# EasyEDA Pro project ProPrj_基于STM32的多功能串口分析仪_2025-03-12.epro, board PCB2_1
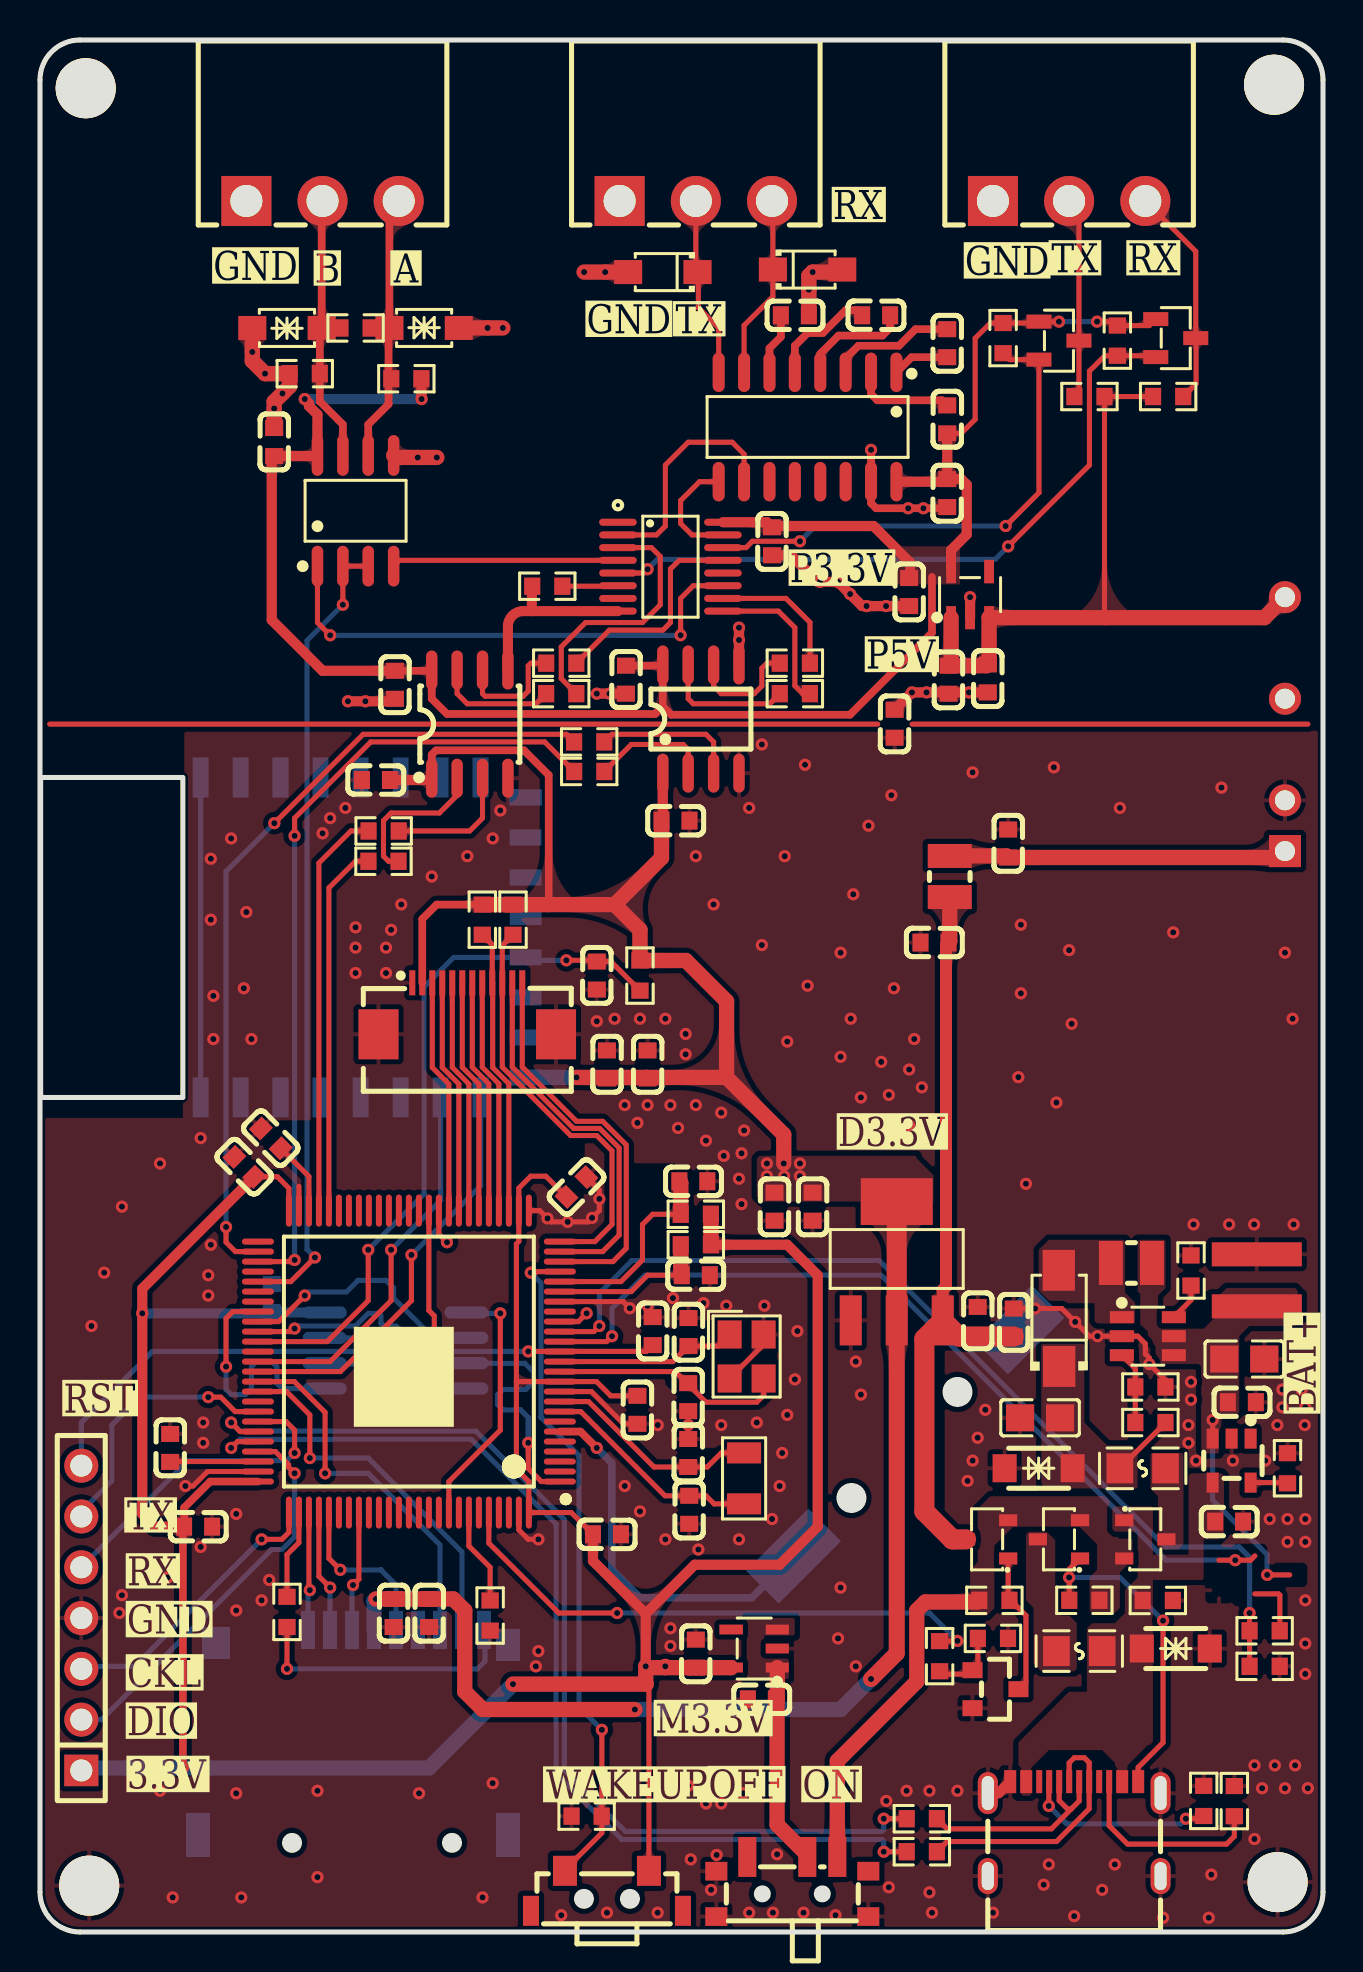
[diagram p15: board, top side]
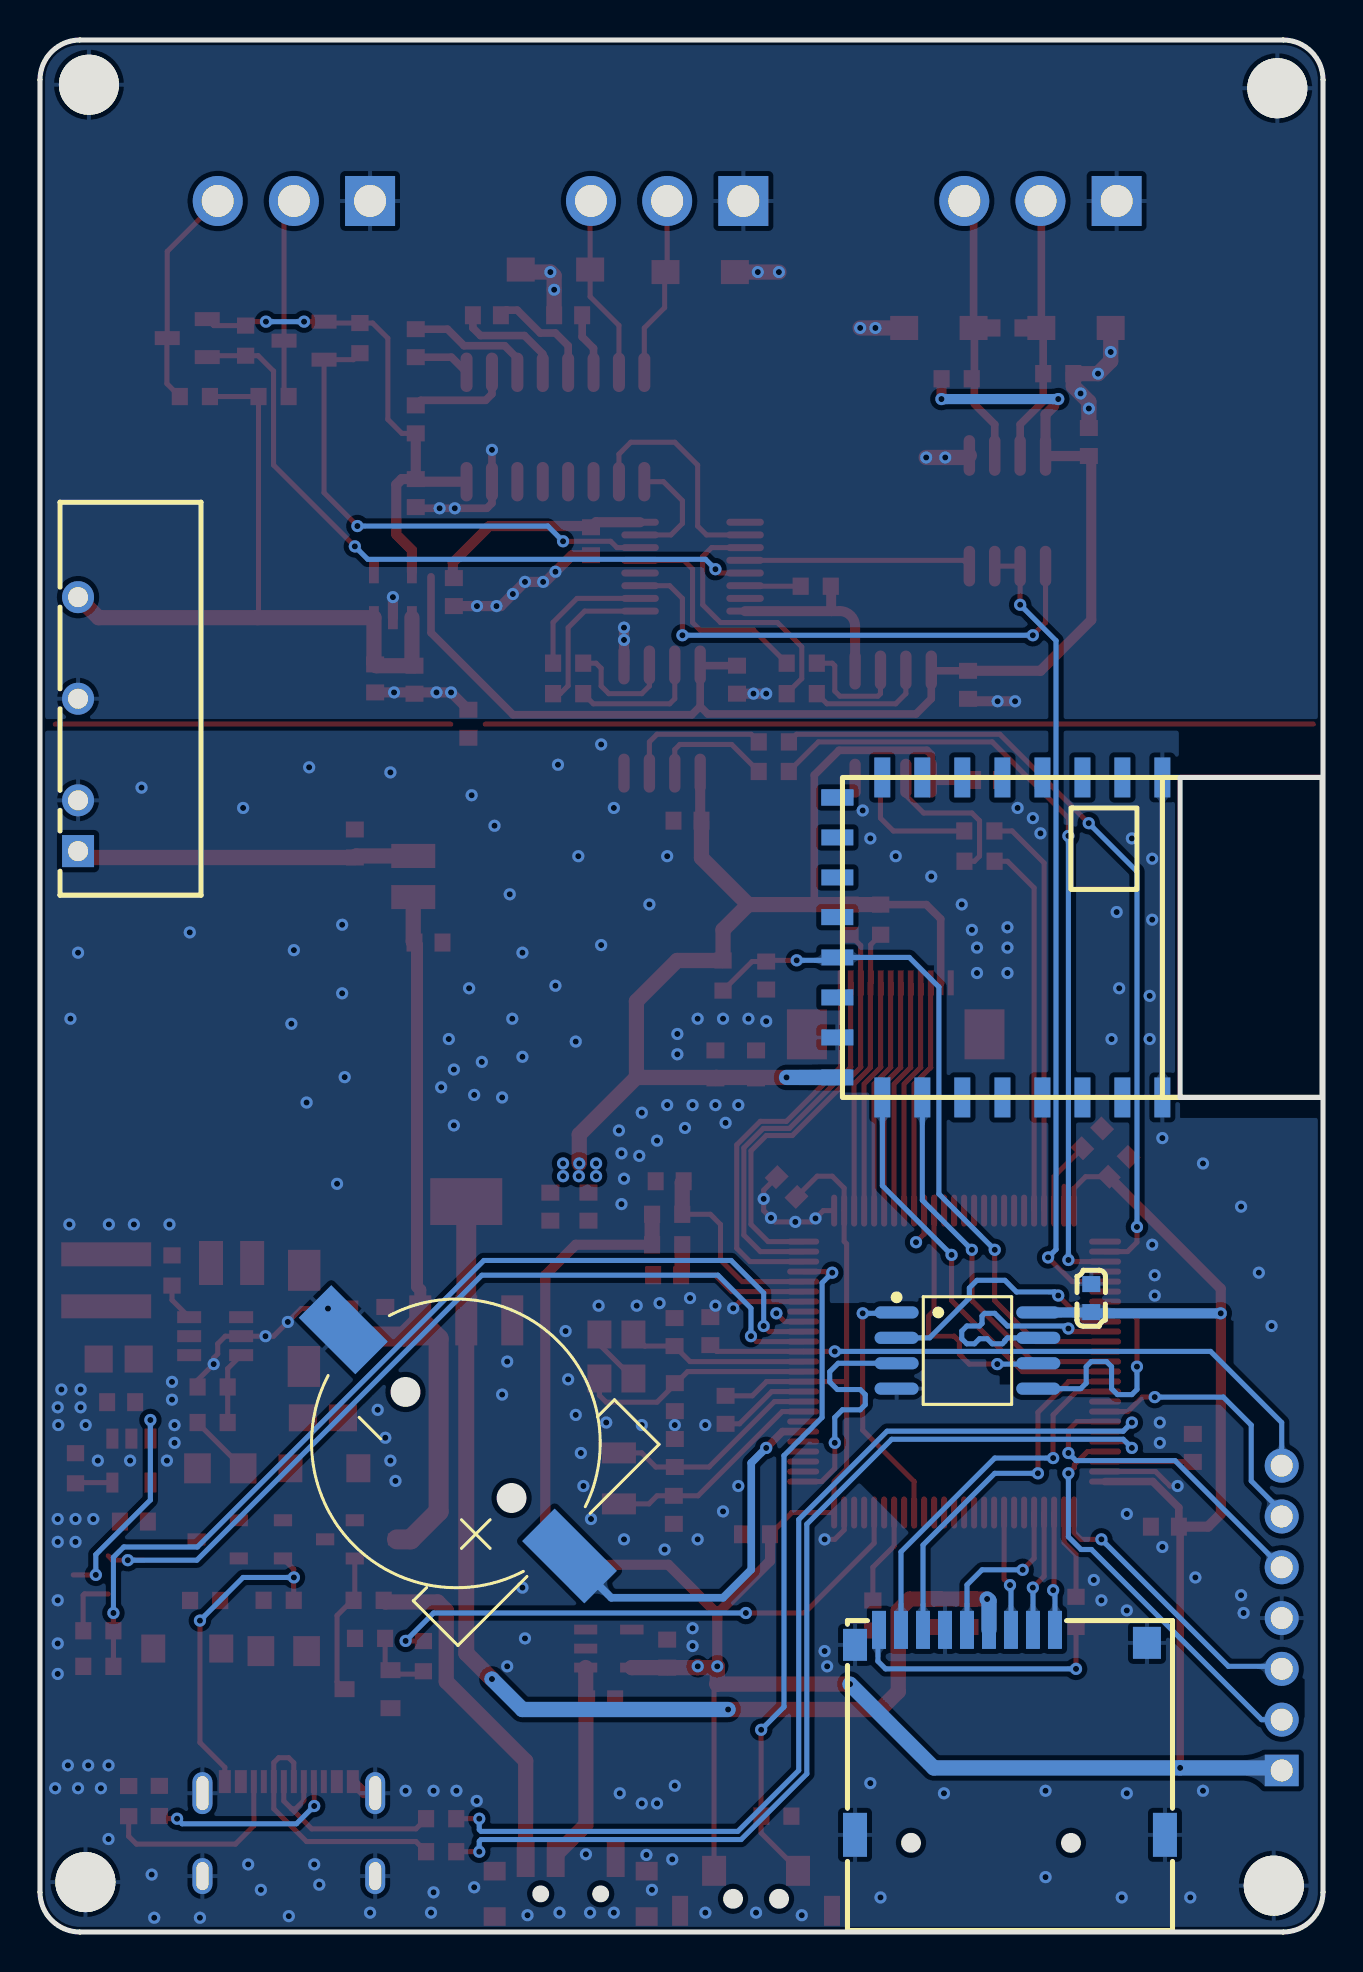
[diagram p16: board, bottom side, seen from below]

Outline 64.17 x 94.62 mm; copper layers: Top Layer, Bottom Layer. Coordinates in mm from the lower left corner of the outline.
Outline path: rectangle 0.03,57.74 7.15,41.73 ; 0,92.62 arc(0.59,94.03) 2,94.62 62.17,94.62 arc(63.58,94.03) 64.17,92.62 64.17,2 arc(63.58,0.59) 62.17,0 2,0 arc(0.59,0.59) 0,2 0,92.62
Stack: Top Layer 0.035mm / Dielectric1 1.51mm FR4 er 4.5 / Bottom Layer 0.035mm

## Design rules (mm)
net PA12: DP1
net PA11: DP1
template: 自定义配置
spacing copperThickness1oz (default): track to track 0.102, other pairs 0.152 to 0.3
spacing copperThickness2oz: track to track 0.203, other pairs 0.152 to 0.3
track width copperThickness1oz (default): min 0.127, default 0.254, max 2.54
track width copperThickness2oz: min 0.203, default 0.254, max 2.54
differential pair differentialPair (default): width min 0.127, default 0.254, max 2.54; gap min 0.152, default 0.152
via viaSize (default): diameter min 0.5, default 0.61, max 10; hole min 0.3, default 0.305, max 6.3
net D3.3V uses PWR
net BAT+ uses PWR
net VBUS uses PWR
net $2N1784 uses PWR
net 5V uses PWR
net $2N3681 uses PWR
net $2N3676 uses PWR
net BAT_5V uses PWR
net $1N15715 uses PWR
net 5V_OUT uses PWR
net $2N39094 uses PWR

## Placement (name value [footprint] x y rotation side)
B1  CR1220-2  [BAT-SMD_CR1220-2]  43.34 24.46 45 bottom
C1  100nF  [C0603]  32.8 32.84 0 top
C2  100nF  [C0603]  30.64 30.05 270 top
C3  100nF  [C0603]  32.68 37.54 180 top
C4  100nF  [C0603]  29.88 26.11 90 top
C5  100nF  [C0603]  26.83 37.26 225 top
C6  100nF  [C0603]  10.22 38.26 315 top
C7  100nF  [C0603]  28.36 19.89 180 top
C8  100nF  [C0603]  7.91 20.27 180 top
C9  1uF  [C0603]  36.1 11.63 0 top
C10  1uF  [C0603]  32.8 13.92 90 top
C11  2.2uF  [C0603]  6.51 24.21 270 top
C12  2.2uF  [C0603]  11.54 39.69 315 top
C13  10pF  [C0603]  32.42 26.75 90 top
C14  10pF  [C0603]  32.42 23.95 270 top
C15  10pF  [C0603]  32.47 21.11 90 top
C16  10pF  [C0603]  32.43 30 90 top
C17  2.2uF  [C0603]  59.47 20.53 180 top
C18  10uF  [C0603]  60.11 26.49 180 top
C19  100nF  [C0603]  45.37 75.64 270 top
C20  100nF  [C0603]  45.37 71.96 90 top
C21  100nF  [C0603]  17.69 15.95 90 top
C22  10uF  [C0603]  19.47 15.95 90 top
C23  100nF  [C0603]  41.82 80.85 0 top
C24  100nF  [C0603]  45.37 79.45 90 top
C25  100nF  [C0603]  37.75 80.85 180 top
C26  22uF  [C0805]  50.02 25.71 0 top
C27  22uF  [C0805]  60.23 28.65 180 top
C28  100nF  [C0603]  16.8 57.61 0 top
C29  100nF  [C0603]  17.75 62.37 270 top
C30  100nF  [C0603]  11.71 74.51 270 top
C31  100nF  [C0603]  31.78 55.58 180 top
C32  100nF  [C0603]  29.31 62.63 270 top
C33  4.7uF  [C0603]  44.74 49.48 0 top
C34  4.7uF  [C0603]  48.42 54.43 270 top
C35  10uF  [C0603]  47.41 62.69 90 top
C36  1uF  [C0603]  45.44 62.62 90 top
C37  1uF  [C0603]  43.47 67.01 270 top
C38  1nF  [C0603]  42.74 60.42 90 top
C39  100nF  [C0603]  36.61 69.55 90 top
C40  100nF  [C0603]  48.7 30.48 270 top
C41  10uF  [C0603]  46.9 30.56 270 top
C42  100nF  [C0603]  36.74 36.27 90 top
C43  10uF  [C0603]  38.64 36.27 90 top
C44  100nF  [C0603]  30.39 43.39 270 top
C45  10uF  [C0603]  28.36 43.39 270 top
C46  100nF  [C0603]  27.85 47.83 270 top
C47  100nF  [C0603]  11.59 31.7 90 bottom
CN1  DB2ERC-3.81-3P-GN  [CONN-TH_3P-P3.81_DB2ERC-3.81-3P]  32.8 86.56 180 top
CN2  DB2ERC-3.81-3P-GN  [CONN-TH_3P-P3.81_DB2ERC-3.81-3P]  14.13 86.56 180 top
CN3  DB2ERC-3.81-3P-GN  [CONN-TH_3P-P3.81_DB2ERC-3.81-3P]  51.47 86.56 180 top
D1  SMF15CA  [SOD-123FL_L2.7-W1.8-LS3.8-RD]  38.39 83.14 0 top
D2  SS34  [SMA_L4.3-W2.6-LS5.0-RD]  50.96 30.69 90 top
D3  SMF15CA  [SOD-123FL_L2.7-W1.8-LS3.8-RD]  31.15 83.01 180 top
D4  SMF6.5CA  [SOD-123FL_L2.7-W1.8-LS3.8-BI]  12.35 80.22 0 top
D5  SMF6.5CA  [SOD-123FL_L2.7-W1.8-LS3.8-BI]  19.21 80.22 180 top
F1  BSMD0805-010-33V  [F0805]  51.98 14.05 180 top
F2  BSMD0805-010-33V  [F0805]  55.15 23.19 0 top
FPC1  FPC-05F-12PH20  [FPC-SMD_12P-P0.50_FPC-05F-12PH20]  21.37 46.18 0 top
H1  -  [HDR-TH_7P-P2.54-V-F]  2.07 15.7 90 top
L1  6.8uH  [IND-SMD_L2.5-W2.0_FHD252010S-6R8MT]  54.58 33.46 0 top
L2  6.8uH  [IND-SMD_L2.5-W2.0_FHD252010S-6R8MT]  45.5 52.78 270 top
NOREF  -  [Pad_e135]  61.72 92.38 90 top
NOREF#2  -  [Pad_e133]  2.46 2.32 270 top
NOREF#3  -  [Pad_e134]  2.29 92.2 180 top
NOREF#4  -  [Pad_e131]  61.9 2.49 0 top
Q1  AO3401  [SOT-23-3_L2.9-W1.4-P1.90-LS2.6-BR]  50.96 19.64 0 top
Q2  AO3401  [SOT-23-3_L2.9-W1.4-P1.90-LS2.6-BR]  47.37 19.63 0 top
Q3  AO3401  [SOT-23-3_L2.9-W1.4-P1.90-LS2.6-BR]  55.28 19.64 180 top
Q4  -  [S8050_SOT-23]  47.79 12.27 180 top
Q5  AO3400A  [SOT-23-3_L2.9-W1.3-P1.90-LS2.4-BR]  56.8 79.71 180 top
Q6  AO3400A  [SOT-23-3_L2.9-W1.3-P1.90-LS2.4-BR]  50.96 79.58 180 top
R1  10Ω  [R0603]  32.8 34.37 180 top
R2  600Ω/100MHZ  [R0603]  32.8 35.89 180 top
R3  10K  [R0603]  22.51 15.83 270 top
R4  5.1K  [R0603]  58.2 6.56 90 top
R5  5.1K  [R0603]  59.73 6.55 90 top
R6  22R  [R0603]  44.1 4.02 180 top
R7  22R  [R0603]  44.1 5.67 180 top
R8  10k  [R0603]  27.34 5.79 0 top
R9  2K  [R0603]  62.39 23.19 90 top
R10  100K  [R0603]  47.73 16.59 0 top
R11  100K  [R0603]  61.25 15.06 180 top
R12  100K  [R0603]  52.23 16.59 180 top
R13  1K  [R0603]  44.99 13.79 270 top
R14  10K  [R0603]  12.35 16.01 270 top
R15  100K  [R0603]  61.25 13.29 0 top
R16  10K  [R0603]  47.66 14.68 0 top
R17  93.1K  [R0603]  57.57 33.08 270 top
R18  20K  [R0603]  55.53 25.48 0 top
R19  100K  [R0603]  55.91 16.58 0 top
R20  2.7K  [R0603]  55.53 27.26 180 top
R21  10K  [R0603]  13.24 77.93 180 top
R22  22R  [R0603]  27.47 58.03 0 top
R23  22R  [R0603]  37.75 61.93 0 top
R24  22R  [R0603]  17.18 53.55 0 top
R25  22R  [R0603]  17.19 55.06 0 top
R26  22R  [R0603]  26.07 61.93 0 top
R27  22R  [R0603]  26.07 63.45 0 top
R28  10K  [R0603]  18.32 77.67 180 top
R29  22R  [R0603]  27.47 59.51 0 top
R30  22R  [R0603]  37.75 63.45 0 top
R31  120  [R0603]  15.78 80.22 180 top
R32  10K  [R0603]  25.37 67.3 0 top
R33  10K  [R0603]  53.88 79.58 270 top
R34  10K  [R0603]  56.42 76.79 0 top
R35  4.7K  [R0603]  30.01 47.83 270 top
R36  10K  [R0603]  48.17 79.71 270 top
R37  10K  [R0603]  52.48 76.79 180 top
R38  4.7K  [R0603]  23.66 50.62 90 top
R39  4.7K  [R0603]  22.12 50.62 90 top
SW1  MK-12C02-G020  [SW-SMD_MK-12C02-G020]  37.63 2.26 0 top
SW2  KAN3543-0351C1-29/449  [SW-SMD_GANGYUAN_KAN3543-0351C1]  28.36 2.06 0 top
U1  RT9013-33GB  [SOT-23-5_L3.0-W1.7-P0.95-LS2.8-BL]  35.72 14.18 90 top
U2  -  [JLC-QRCODE-5x5]  18.2 27.76 0 top
U3  GX4054  [SOT-23-5_L2.9-W1.6-P0.95-LS2.8-BR]  59.6 23.57 90 top
U4  MR01A-01239  [TF-SMD_MR01A-01211]  15.66 9.98 180 bottom
U5  ZX-XH2.54-2PLT  [BAT+]  63.28 32.59 90 top
U6  SMF6.0CA  [SOD-123FL_L2.8-W1.8-LS3.7-BI]  56.8 14.18 180 top
U7  MAX3232ESE  [SOIC-16_L9.9-W3.9-P1.27-LS6.0-BL]  38.39 75.26 180 top
U8  SMF6.0CA  [SOD-123FL_L2.8-W1.8-LS3.7-BI]  49.95 23.19 0 top
U9  MT3608L  [SOT-23-6_L2.9-W1.6-P0.95-LS2.8-BL_3]  55.41 29.8 270 top
U10  B0505S-1W  [PWRM-TH_B0505S-3WR2]  62.26 60.4 90 bottom
U11  RT9013-33GB  [SOT-23-5_L3.0-W1.7-P0.95-LS2.8-BL]  46.52 66.88 0 top
U12  MAX3485ESA  [SOP-8_L5.0-W4.0-P1.27-LS6.0-BL]  15.78 71.07 0 top
U13  π121M31  [SOIC-8_L5.0-W4.0-P1.27-LS6.0-BL]  21.5 60.4 0 top
U14  π120U31  [soic-8_l5.0-w4.0-p1.27-ls6.0-bl]  33.05 60.66 0 top
U15  -  [E103-W11]  14.39 49.1 270 bottom
U16  RS2252XSS16  [SSOP-16_L4.9-W3.9-P0.635-LS6.0-BL]  31.53 68.28 270 top
U17  W25Q64JVSSIQ  [SOP-8_L5.3-W5.3-P1.27-LS8.0-BL]  17.78 29.08 270 bottom
U18  STM32H750VBT6  [LQFP-100_L14.0-W14.0-P0.50-LS16.0-BL]  18.45 28.53 90 top
USB1  TYPE-C 16P(073)  [USB-C-SMD_TYPE-C16PIN_C668624]  51.72 5.16 0 top
V1  AMS1117-3V3  [SOT89-3_HOUSING_REVA_02SEP2012]  43.09 35.13 0 top
X1  24MHz  [CRYSTAL-SMD_4P-L3.2-W2.5-BL]  35.34 28.78 270 top
X2  32.768kHz  [CRYSTAL-SMD_L3.2-W1.5-1]  35.21 22.68 270 top

## Footprints (pads in the part's own frame, mm; a bottom-side part is the same pattern mirrored in y, then rotated)
BAT+
  rect 1.2x4.5 smd: 1(-1.3,2.425) 2(1.3,2.425)
BAT-SMD_CR1220-2
  rect 4.4x2.3 smd: 1(-8,0)
  rect 4x2.3 smd: 2(8,0)
C0603
  rect 0.8x0.9 smd: 1(-0.7,0) 2(0.7,0)
C0805
  rect 1.41x1.35 smd: 1(-1,0) 2(1,0)
CONN-TH_3P-P3.81_DB2ERC-3.81-3P
  rect 2.5x2.5 hole 1.6: 1(3.81,0)
  round 2.5 hole 1.6: 2(0,0) 3(-3.81,0)
CRYSTAL-SMD_4P-L3.2-W2.5-BL
  rect 1.4x1.2 smd: 1(-1.1,-0.85) 2(1.1,-0.85) 3(1.1,0.85) 4(-1.1,0.85)
CRYSTAL-SMD_L3.2-W1.5-1
  rect 1.05x1.7 smd: 1(-1.275,0) 2(1.275,0)
E103-W11
  rect 2x0.8 smd: 1(-8.636,6.35) 2(-8.636,4.35) 3(-8.636,2.354) 4(-8.636,0.351) 5(-8.636,-1.649) 6(-8.636,-3.655) 7(-8.636,-5.655) 8(-8.636,-7.655) 17(7.364,-7.654) 18(7.364,-5.654) 19(7.364,-3.654) 20(7.364,-1.648) 21(7.364,0.352) 22(7.364,2.355) 23(7.364,4.351) 24(7.364,6.351)
  rect 0.8x1.6 smd: 9(-7.636,-9.903) 9(-7.636,-9.903) 10(-5.636,-9.903) 11(-3.636,-9.903) 12(-1.651,-9.906) 13(0.364,-9.903) 14(2.364,-9.903) 15(4.364,-9.903) 16(6.364,-9.903)
F0805
  rect 1.335x1.5 smd: 1(-1.143,0) 2(1.143,0)
FPC-SMD_12P-P0.50_FPC-05F-12PH20
  rect 0.3x1.25 smd: 1(-2.75,1.288) 2(-2.25,1.288) 3(-1.75,1.288) 4(-1.25,1.288) 5(-0.75,1.288) 6(-0.25,1.288) 7(0.25,1.288) 8(0.75,1.288) 9(1.25,1.288) 10(1.75,1.288) 11(2.25,1.288) 12(2.75,1.288)
  rect 2x2.5 smd: 13(4.44,-1.288) 14(-4.44,-1.288)
HDR-TH_7P-P2.54-V-F
  rect 1.575x1.7 hole 1.1: 1(-7.62,0)
  round 1.7 hole 1.1: 2(-5.08,0) 3(-2.54,0) 4(0,0) 5(2.54,0) 6(5.08,0) 7(7.62,0)
IND-SMD_L2.5-W2.0_FHD252010S-6R8MT
  rect 1.2x2.2 smd: 1(1.028,0) 2(-1.028,0)
LQFP-100_L14.0-W14.0-P0.50-LS16.0-BL
  oval 0.3x1.6 smd: 1(-6,-7.55) 2(-5.5,-7.55) 3(-5,-7.55) 4(-4.5,-7.55) 5(-4,-7.55) 6(-3.5,-7.55) 7(-3,-7.55) 8(-2.5,-7.55) 9(-2,-7.55) 10(-1.5,-7.55) 11(-1,-7.55) 12(-0.5,-7.55) 13(0,-7.55) 14(0.5,-7.55) 15(1,-7.55) 16(1.5,-7.55) 17(2,-7.55) 18(2.5,-7.55) 19(3,-7.55) 20(3.5,-7.55) 21(4,-7.55) 22(4.5,-7.55) 23(5,-7.55) 24(5.5,-7.55) 25(6,-7.55) 51(6,7.55) 52(5.5,7.55) 53(5,7.55) 54(4.5,7.55) 55(4,7.55) 56(3.5,7.55) 57(3,7.55) 58(2.5,7.55) 59(2,7.55) 60(1.5,7.55) 61(1,7.55) 62(0.5,7.55) 63(0,7.55) 64(-0.5,7.55) 65(-1,7.55) 66(-1.5,7.55) 67(-2,7.55) 68(-2.5,7.55) 69(-3,7.55) 70(-3.5,7.55) 71(-4,7.55) 72(-4.5,7.55) 73(-5,7.55) 74(-5.5,7.55) 75(-6,7.55)
  oval 1.6x0.3 smd: 26(7.55,-6) 27(7.55,-5.5) 28(7.55,-5) 29(7.55,-4.5) 30(7.55,-4) 31(7.55,-3.5) 32(7.55,-3) 33(7.55,-2.5) 34(7.55,-2) 35(7.55,-1.5) 36(7.55,-1) 37(7.55,-0.5) 38(7.55,0) 39(7.55,0.5) 40(7.55,1) 41(7.55,1.5) 42(7.55,2) 43(7.55,2.5) 44(7.55,3) 45(7.55,3.5) 46(7.55,4) 47(7.55,4.5) 48(7.55,5) 49(7.55,5.5) 50(7.55,6) 76(-7.55,6) 77(-7.55,5.5) 78(-7.55,5) 79(-7.55,4.5) 80(-7.55,4) 81(-7.55,3.5) 82(-7.55,3) 83(-7.55,2.5) 84(-7.55,2) 85(-7.55,1.5) 86(-7.55,1) 87(-7.55,0.5) 88(-7.55,0) 89(-7.55,-0.5) 90(-7.55,-1) 91(-7.55,-1.5) 92(-7.55,-2) 93(-7.55,-2.5) 94(-7.55,-3) 95(-7.55,-3.5) 96(-7.55,-4) 97(-7.55,-4.5) 98(-7.55,-5) 99(-7.55,-5.5) 100(-7.55,-6)
Pad_e131
  round 3 hole 3: 43(0,0)
Pad_e133
  round 3 hole 3: 43(0,0)
Pad_e134
  round 3 hole 3: 43(0,0)
Pad_e135
  round 3 hole 3: 44(0,0)
PWRM-TH_B0505S-3WR2
  rect 1.6x1.6 hole 1: 1(-6.35,0)
  round 1.6 hole 1: 2(-3.81,0) 4(1.27,0) 6(6.35,0)
R0603
  rect 0.806x0.864 smd: 1(-0.753,0) 2(0.753,0)
S8050_SOT-23
  rect 1x0.8 smd: 1(1.15,-0.823) 2(1.15,1.077) 3(-1.15,0.127)
SMA_L4.3-W2.6-LS5.0-RD
  rect 2.046x1.62 smd: 1(-2.404,-0.009) 2(2.404,0.009)
SOD-123FL_L2.7-W1.8-LS3.8-BI
  rect 1.4x1.2 smd: 1(-1.735,0) 2(1.735,0)
SOD-123FL_L2.7-W1.8-LS3.8-RD
  rect 1.4x1.2 smd: 1(-1.735,0) 2(1.735,0)
SOD-123FL_L2.8-W1.8-LS3.7-BI
  rect 1.2x1.4 smd: 1(-1.7,0) 2(1.7,0)
soic-8_l5.0-w4.0-p1.27-ls6.0-bl
  oval 0.569x1.95 smd: 1(-1.905,-2.705) 2(-0.635,-2.705) 3(0.635,-2.705) 4(1.905,-2.705) 5(1.905,2.705) 6(0.635,2.705) 7(-0.635,2.705) 8(-1.905,2.705)
SOIC-8_L5.0-W4.0-P1.27-LS6.0-BL
  oval 0.569x1.95 smd: 1(-1.905,-2.705) 2(-0.635,-2.705) 3(0.635,-2.705) 4(1.905,-2.705) 5(1.905,2.705) 6(0.635,2.705) 7(-0.635,2.705) 8(-1.905,2.705)
SOIC-16_L9.9-W3.9-P1.27-LS6.0-BL
  oval 0.602x1.971 smd: 1(-4.445,-2.736) 2(-3.175,-2.736) 3(-1.905,-2.736) 4(-0.635,-2.736) 5(0.635,-2.736) 6(1.905,-2.736) 7(3.175,-2.736) 8(4.445,-2.736) 9(4.445,2.736) 10(3.175,2.736) 11(1.905,2.736) 12(0.635,2.736) 13(-0.635,2.736) 14(-1.905,2.736) 15(-3.175,2.736) 16(-4.445,2.736)
SOP-8_L5.0-W4.0-P1.27-LS6.0-BL
  oval 0.574x2.035 smd: 1(-1.905,-2.768) 2(-0.635,-2.768) 3(0.635,-2.768) 4(1.905,-2.768) 5(1.905,2.768) 6(0.635,2.768) 7(-0.635,2.768) 8(-1.905,2.768)
SOP-8_L5.3-W5.3-P1.27-LS8.0-BL
  oval 0.609x2.204 smd: 1(-1.905,-3.542) 2(-0.635,-3.542) 3(0.635,-3.542) 4(1.905,-3.542) 5(1.905,3.542) 6(0.635,3.542) 7(-0.635,3.542) 8(-1.905,3.542)
SOT89-3_HOUSING_REVA_02SEP2012
  rect 1.1x2.5 smd: 1(-2.539,-4.544) 2(-0.239,-4.544) 3(2.061,-4.544)
  rect 3.6x2.34 smd: 2(-0.239,1.396)
SOT-23-3_L2.9-W1.3-P1.90-LS2.4-BR
  rect 1.25x0.7 smd: 1(1,-0.95) 2(1,0.95) 3(-1,0)
SOT-23-3_L2.9-W1.4-P1.90-LS2.6-BR
  rect 0.91x0.6 smd: 1(1.055,-0.955) 2(1.055,0.955) 3(-1.055,0)
SOT-23-5_L2.9-W1.6-P0.95-LS2.8-BR
  rect 1x0.6 smd: 1(1.1,-0.95) 2(1.1,0) 3(1.1,0.95) 4(-1.1,0.95) 5(-1.1,-0.95)
SOT-23-5_L3.0-W1.7-P0.95-LS2.8-BL
  rect 0.49x1.157 smd: 1(-0.95,-1.153) 2(0,-1.153) 3(0.95,-1.153)
  rect 0.49x1.175 smd: 4(0.95,1.153) 5(-0.95,1.153)
SOT-23-6_L2.9-W1.6-P0.95-LS2.8-BL_3
  rect 0.6x1.2 smd: 1(-0.95,-1.3) 2(0,-1.3) 3(0.95,-1.3) 4(0.95,1.3) 5(0,1.3) 6(-0.95,1.3)
SSOP-16_L4.9-W3.9-P0.635-LS6.0-BL
  oval 0.35x1.876 smd: 1(-2.223,-2.626) 2(-1.587,-2.626) 3(-0.953,-2.626) 4(-0.318,-2.626) 5(0.318,-2.626) 6(0.953,-2.626) 7(1.587,-2.626) 8(2.223,-2.626) 9(2.223,2.626) 10(1.587,2.626) 11(0.953,2.626) 12(0.318,2.626) 13(-0.318,2.626) 14(-0.953,2.626) 15(-1.587,2.626) 16(-2.223,2.626)
SW-SMD_GANGYUAN_KAN3543-0351C1
  rect 1.2x1.5 smd: 1(-2.1,1) 2(2.1,1)
  rect 0.8x1.5 smd: 3(3.8,-1) 4(-3.8,-1)
SW-SMD_MK-12C02-G020
  rect 0.9x2 smd: 1(-2.25,1.49) 2(0.75,1.49) 3(2.25,1.49)
  rect 1.1x0.93 smd: 4(3.8,0.779) 5(3.8,-1.49) 6(-3.8,-1.49) 7(-3.8,0.779)
TF-SMD_MR01A-01211
  rect 0.7x1.9 smd: 1(2.25,5.125) 2(1.15,5.125) 3(0.05,5.125) 4(-1.05,5.125) 5(-2.15,5.125) 6(-3.25,5.125) 7(-4.35,5.125) 8(-5.45,5.125) 9(-6.55,5.125)
  rect 1.2x1.6 smd: 10(-7.75,4.375)
  rect 1.2x2.2 smd: 11(-7.75,-5.125) 12(7.75,-5.125)
  rect 1.4x1.6 smd: 13(6.85,4.475)
USB-C-SMD_TYPE-C16PIN_C668624
  oval 1x2.1 hole 0.6x1.7: 1(-4.32,1.788) 2(4.32,1.788)
  oval 1x1.8 hole 0.6x1.4: 3(-4.32,-2.362) 4(4.32,-2.362)
  rect 0.6x1.15 smd: A1B12(-3.2,2.362) A4B9(-2.4,2.362) B1A12(3.2,2.362) B4A9(2.4,2.362)
  rect 0.3x1.15 smd: A5(-1.25,2.362) A6(-0.25,2.362) A7(0.25,2.362) A8(1.25,2.362) B5(1.75,2.362) B6(0.75,2.362) B7(-0.75,2.362) B8(-1.75,2.362)

## Nets
As in the schematic, except:
GND: B1.2 C1.2 C2.1 C3.1 C4.1 C5.1 C6.1 C7.1 C8.1 C9.1 C10.2 C11.1 C12.1 C13.1 C14.1 C15.1 C16.2 C17.1 C18.1 C21.1 C22.1 C26.1 C27.1 C28.1 C31.1 C33.1 C34.1 C38.1 C40.1 C41.1 C42.1 C43.1 C44.1 C45.1 C46.2 C47.2 FPC1.1 FPC1.13 FPC1.14 H1.4 NOREF#2.43 NOREF#4.43 Q4.2 R3.2 R4.2 R5.2 R8.1 R9.2 R15.2 R16.2 R17.1 R19.2 R20.1 SW1.1 SW1.5 SW1.6 SW1.7 U1.2 U3.2 U4.6 U4.10 U4.11 U4.12 U4.13 U5.2 U6.1 U8.1 U9.2 U10.2 U13.4 U14.4 U15.1 U15.15 U15.24 U17.4 U18.10 U18.19 U18.26 U18.49 U18.74 U18.99 USB1.1 USB1.2 USB1.3 USB1.4 USB1.A1B12 V1.1 X1.2 X1.4
PGND: C20.1 C25.1 C29.2 C30.1 C32.2 C35.1 C36.1 C37.2 C38.2 C39.1 CN1.1 CN2.1 CN3.1 D1.2 D3.2 D4.1 D5.1 NOREF.44 NOREF#3.43 R21.2 R32.1 U7.15 U10.4 U11.2 U12.5 U13.5 U14.5 U16.8

Pads without a net: SW1 4; SW2 3 4; U1 4; U3 1; U7 11 12 13 14; U11 4; U15 2 3 4 5 6 7 8 9 10 11 12 14 19 20 21 22 23; U16 1 7 12; USB1 A8 B8

## Via types
v1: diameter 0.61, hole 0.305, Top Layer to Bottom Layer, 317 vias

## Routing (per net, layer and track width the routed paths; a pad name or vN(x,y) marks a point on that pad's centre or on a via; arc(x,y) is an arc through that point)
5V: length 17.3
  Top Layer w0.762: SW1.3 39.88,8.55 43.85,12.52 43.85,16.08 44.27,16.5 46.9,16.5 R10.1
5V_OUT: length 37.8
  Top Layer w0.6: C33.2 45.31,49.35 45.31,32.27 45.15,32.11 V1.3
  Top Layer w0.762: C33.2 45.5,49.54 L2.1
  Top Layer w1: C40.2 45.96,29.78 V1.3 44.23,29.67 44.23,21.03 45.63,19.63 Q2.3
D3.3V: length 120.9
  Top Layer w0.381: R39.2 19.84,51.38 19.12,50.66 FPC1.2 ; 25.44,51.38 25.44,57.85 24.2,59.09 19.81,59.09 19.59,58.88 U13.1
  Top Layer w0.508: C31.2 31.15,55.64 U14.1 ; U13.1 19.5,57.61 17.5,57.61
  Top Layer w0.762: 34.34,42.74 37.2,39.88 v1(37.2,38.43) ; 34.34,42.74 30.34,42.74 ; 34.34,42.74 34.34,46.55 32.3,48.58 R35.1 30.01,50.12 28.74,51.38 ; 28.74,51.38 31.08,53.72 C31.2 ; 28.74,51.38 R38.2 R39.2 ; v1(16.8,16.65) C21.2 C22.2 20.67,16.65 21.24,16.08 21.24,12.02 22.14,11.13 v1(29.75,11.13) ; 30.34,42.74 C44.2 ; 30.34,42.74 v1(26.83,42.74)
  Top Layer w0.8: V1.2 42.85,13.94 v1(41.56,12.65)
  Top Layer w1: V1.2 V1.2
  Bottom Layer w0.762: U15.16 v1(26.83,42.74) ; v1(41.56,12.65) 40.04,11.13 v1(29.75,11.13) ; v1(16.8,16.65) 16.7,16.56 U4.4
  vias: v1(36.36,38.43) v1(36.36,37.8) v1(37.22,37.8) v1(38.01,38.43) v1(38.01,37.8)
GND: length 51.5
  Top Layer w0.254: U18.26 24.99,36.08 25.56,35.51 v1(26.39,35.51) 27.41,35.51 27.97,36.08 v1(27.97,36.66) 27.97,37.1 C5.1 ; 10.9,23.03 8.38,23.03 7.65,22.3 v1(7.27,22.3) ; R20.1 56.29,27.59 v1(55.48,28.4) 55.48,28.71 55.28,28.91 55.28,29.42 54.9,29.8 U9.2 v1(52.89,29.8) 52.48,29.8 v1(51.77,30.51) 51.1,31.18 v1(49.76,31.18) C40.1 ; U18.49 12.95,37.29 ; U18.99 23.95,20.1 24.42,19.64 v1(24.93,19.64) ; U18.19 29.17,31.53 v1(29.5,31.19) ; C4.1 29.18,25.41 27.57,27.03 U18.10 ; X1.4 36.19,29.38 X1.2
  Top Layer w0.508: USB1.1 47.95,6.95 USB1.A1B12
  Bottom Layer w0.254: U15.1 8.04,41.74
  vias: v1(2.57,30.3) v1(3.21,32.97) v1(3.97,15.95) v1(4.1,36.27) v1(4.1,16.84) v1(6,38.43) v1(6,7.06) v1(6.38,17.73) v1(6.64,1.73) v1(8.04,39.7) v1(8.04,19.25) v1(8.16,25.48) v1(8.16,24.46) v1(8.42,32.84) v1(8.42,31.83) v1(8.54,53.67) v1(8.54,50.62) v1(8.54,34.37) v1(8.67,46.81) v1(8.67,44.66) v1(9.56,54.69) v1(9.81,20.91) v1(9.81,16.08) v1(9.81,6.94) v1(10.07,1.73) v1(10.19,47.2) v1(10.32,51.01) v1(10.58,44.66) v1(11.08,16.59) v1(11.46,17.6) v1(13.88,7.06) v1(13.88,2.75) v1(14.13,54.94) v1(14.51,55.7) v1(15.27,56.21) v1(15.78,50.24) v1(15.78,49.23) v1(15.78,47.96) v1(17.31,49.23) v1(17.31,47.96) v1(17.56,50.12) v1(18.07,51.39) v1(18.96,6.94) v1(19.59,52.78) v1(21.37,53.8) v1(22.13,1.73) v1(22.64,54.69) v1(22.64,7.44) v1(23.02,56.09) v1(24.8,13.29) v1(24.93,14.05) v1(25.38,35.69) v1(26.07,0.84) v1(27.61,35.71) v1(27.85,45.54) v1(28.36,0.97) v1(28.74,45.67) v1(29.24,41.35) v1(29.24,22.3) v1(29.88,40.46) v1(30.01,45.67) v1(30.01,21.03) v1(30.39,41.35) v1(30.39,31.32) v1(30.89,25.35) v1(30.89,0.97) v1(31.28,45.67) v1(31.28,19.64) v1(31.53,41.35) v1(31.53,15.19) v1(31.53,14.3) v1(31.66,31.7) v1(31.91,40.21) v1(32.29,44.91) v1(32.29,43.89) v1(32.42,25.35) v1(32.42,7.32) v1(32.55,3.63) v1(32.8,53.8) v1(32.8,41.35) v1(32.93,19.13) v1(33.18,31.45) v1(33.31,39.58) v1(33.31,6.43) v1(33.56,2.11) v1(33.69,51.39) v1(33.84,3.85) v1(34.07,40.97) v1(34.07,25.35) v1(34.07,6.43) v1(34.2,38.81) v1(34.32,31.32) v1(34.96,37.67) v1(34.96,19.64) v1(35.09,38.94) v1(35.09,36.4) v1(35.17,6.94) v1(35.21,40.08) v1(35.47,56.21) v1(35.47,0.97) v1(35.85,25.48) v1(36.1,59.39) v1(36.1,49.35) v1(36.23,31.32) v1(36.61,20.65) v1(36.66,0.97) v1(36.86,3.89) v1(36.99,22.3) v1(37.12,23.95) v1(37.25,53.8) v1(37.37,44.53) v1(37.37,25.86) v1(37.75,27.64) v1(37.88,30.05) v1(38.26,58.37) v1(38.19,0.97) v1(38.39,47.32) v1(39.79,0.84) v1(39.91,14.68) v1(40.04,48.97) v1(40.04,43.77) v1(40.04,17.22) v1(40.55,45.67) v1(40.67,51.89) v1(40.8,28.53) v1(40.8,13.29) v1(41.05,41.73) v1(41.05,26.88) v1(41.44,55.32) v1(42.07,43.51) v1(42.33,6.56) v1(42.45,41.86) v1(42.45,2.24) v1(42.58,56.85) v1(42.71,47.2) v1(43.34,7.06) v1(43.47,43.13) v1(43.47,40.34) v1(43.72,44.66) v1(44.1,42.24) v1(44.48,7.06) v1(44.48,1.98) v1(44.61,0.97) v1(45.88,7.06) v1(46.39,22.56) v1(46.64,57.99) v1(46.64,23.57) v1(46.9,24.72) v1(47.28,26.11) v1(47.66,0.97) v1(48.93,42.75) v1(49.06,50.37) v1(49.06,46.94) v1(49.31,37.42) v1(50.2,2.36) v1(50.45,3.38) v1(50.71,58.24) v1(50.83,41.48) v1(51.47,49.1) v1(51.6,45.42) v1(51.72,0.79) v1(53.12,2.11) v1(53.76,3.38) v1(54.01,56.21) v1(56.17,0.71) v1(56.68,49.99) v1(57.44,25.35) v1(57.44,24.46) v1(57.57,27.51) v1(57.57,26.62) v1(57.69,35.38) v1(57.82,23.57) v1(58.45,0.71) v1(58.58,2.87) v1(59.09,57.23) v1(59.47,35.38) v1(59.66,23.57) v1(60.72,35.38) v1(60.74,8.33) v1(60.74,4.65) v1(61.12,7.19) v1(61.27,23.57) v1(61.5,20.65) v1(61.76,8.33) v1(61.88,25.35) v1(62.14,27.13) v1(62.14,26.24) v1(62.26,48.97) v1(62.26,7.19) v1(62.39,20.65) v1(62.39,19.51) v1(62.64,45.67) v1(62.7,35.38) v1(62.77,8.33) v1(63.1,27.13) v1(63.28,26.24) v1(63.25,25.35) v1(63.28,20.65) v1(63.28,19.51) v1(63.28,16.59) v1(63.28,14.43) v1(63.28,12.91) v1(63.41,7.19)
PGND: length 52.9
  Top Layer w0.381: C20.1 45.31,71.2 v1(44.18,71.2) v1(43.42,71.2) 41.82,71.2 41.56,71.45 v1(41.56,74.12)
  Top Layer w0.5: v1(15.4,61.55) v1(16.27,61.55) 17.63,61.55 C29.2 ; U13.5 23.4,65.29 arc(23.63,65.83) 24.16,66.05 24.6,66.05 ; 24.6,66.05 24.6,67.28 arc(24.6,67.29) R32.1 ; 24.6,66.05 U16.8
  Top Layer w0.508: U11.2 v1(46.52,66.75) ; v1(27.85,61.93) v1(28.48,61.93) C32.2 ; C37.2 v1(42.31,66.31) 41.12,66.31 v1(40.52,66.91) v1(39.91,67.52) v1(39,67.52) 38.9,67.52 v1(38.39,68.02) 37.56,68.85 C39.1 ; C35.1 v1(46.46,61.99) v1(44.34,61.99) v1(43.61,61.99) C38.2 ; U14.5 v1(34.96,64.61) v1(34.96,65.23)
  Top Layer w0.762: v1(23.15,80.22) v1(22.39,80.22) D5.1 ; v1(19.85,73.74) v1(18.89,73.74) 17.79,73.74 U12.5 ; D3.2 v1(28.27,83.01) v1(27.21,83.01) ; D4.1 v1(10.62,79.01) 10.62,78.56 v1(11.25,77.93) R21.2 12.49,77.3 v1(12.13,76.94) 11.71,76.53 v1(11.71,76.19) C30.1 ; 38.45,80.85 v1(38.45,82.13) 38.45,82.82 v1(38.64,83.01) 40,83.01 40.12,83.14
  vias: v1(41.34,66.31)
PVDD: length 102
  Top Layer w0.254: Q5.1 55.48,80.33 R33.1 53.69,80.53 v1(52.87,80.53) ; v1(50.96,80.53) Q6.1 49.89,80.46 R36.1 47.53,80.46 46.77,79.7 46.77,75.64 46.07,74.94 C19.2
  Top Layer w0.381: 31.15,61.29 31.57,60.87 40.51,60.87 44.61,64.98 44.61,67.77 ; 31.15,61.29 U14.8 31.11,63.33 29.31,63.33 ; 31.15,61.29 30.77,60.91 20.35,60.91 19.59,61.67 U13.8 19.55,63.07 C29.1
  Top Layer w0.508: C20.2 46.07,72.66 46.35,72.38 46.35,69.89 45.57,69.11 U11.5 ; C20.2 45.24,72.53 U7.16 ; C20.2 C19.2 ; C29.1 14.13,63.07 11.59,65.61 11.59,73.69 C30.2 13.85,73.81 U12.8 13.88,75.89 13.45,76.31 13.46,76.44 v1(13.24,76.66) ; R28.1 19.08,76.67 v1(19.08,76.66) ; U16.16 36.36,70.5 C39.2 36.67,70.31 41.69,70.31 43.52,68.48 43.52,67.76 C37.1
  Bottom Layer w0.254: v1(50.96,80.53) v1(52.87,80.53)
  Bottom Layer w0.508: v1(19.08,76.66) v1(13.24,76.66)
VBAT: length 19.1
  Top Layer w0.381: U18.6 27.03,25.03 v1(27.85,24.21)
  Bottom Layer w0.381: B1.1 35.59,16.72 30.01,16.72 28.6,18.12 28.6,23.46 v1(27.85,24.21)
232_RX: length 5.8
  Top Layer w0.254: 33.94,72.53 32.99,72.53 32.04,71.58 32.04,70.44 32.61,69.86 U16.15
232_RXD: length 9
  Top Layer w0.254: 33.94,78 33.94,80.22 32.93,81.23 32.93,82.97 D3.1 32.8,83.09 CN1.2
232_TX: length 11.6
  Top Layer w0.254: U16.2 30.83,69.86 31.28,70.31 31.28,73.36 32.42,74.5 34.62,74.5 35.21,73.9 U7.10
232_TXD: length 9.2
  Top Layer w0.254: U7.7 35.21,80.34 36.65,81.78 D1.1 36.65,86.52 CN1.3
485_A: length 12.9
  Top Layer w0.381: CN2.3 17.48,86.1 D5.2 ; 16.42,73.84 16.42,75.39 17.43,76.41 17.43,79.79
485_B: length 13.3
  Top Layer w0.381: CN2.2 14.09,86.52 D4.2 14,80.12 R21.1 14,76.54 15.15,75.39 U12.7
485_RE: length 40.1
  Top Layer w0.254: 10.9,32.53 12.54,32.53 v1(13.75,33.73) ; v1(15.15,66.37) U12.2 16.42,68.3
  Bottom Layer w0.254: v1(15.15,66.37) 13.35,64.58 13.35,34.13 v1(13.75,33.73)
485_RX: length 25.5
  Top Layer w0.254: v1(14.51,64.85) 13.88,65.48 U12.1 ; U16.11 32.67,67.32 32.04,66.69 v1(32.04,64.85)
  Bottom Layer w0.254: v1(32.04,64.85) v1(14.51,64.85)
485_TX: length 11.3
  Top Layer w0.254: U16.4 17.98,68.59 U12.4
ADC_BAT: length 48.5
  Top Layer w0.254: R15.1 R11.2 v1(60.49,15.95) ; v1(27.97,30.3) 27.7,30.03 26,30.03
  Bottom Layer w0.254: v1(27.97,30.3) 27.97,31.95 29.6,33.58 41.97,33.58 56.3,19.25 59.98,19.25 60.49,18.74 v1(60.49,15.95)
BAT+: length 14
  Top Layer w0.254: R11.1 62.01,15.07 62.01,16.84 61.94,16.91 60.76,16.91 ; v1(61.38,17.86) 62.5,17.86 ; U3.3 v1(58.65,25.61)
  Bottom Layer w0.254: v1(61.38,17.86) 61.38,18.87 58.65,21.6 v1(58.65,25.61)
BAT_5V: length 3.2
  Top Layer w0.254: R18.2 56.29,25.47 F2.1
KEY1: length 33.6
  Top Layer w0.254: v1(28.1,10.11) 28.1,4.96 26.26,3.11 ; U18.22 24.85,33.03 24.8,32.97 v1(24.55,32.97)
  Bottom Layer w0.254: v1(24.55,32.97) 25.05,32.46 25.05,25.73 26.96,23.83 26.96,11.25 v1(28.1,10.11)
LCD_BL: length 11.7
  Top Layer w0.254: FPC1.3 19.62,43.23 20.45,42.4 U18.34
LCD_CLK: length 11.7
  Top Layer w0.254: FPC1.8 22.12,43.24 22.95,42.42 U18.29
LCD_CS: length 11.7
  Top Layer w0.254: FPC1.7 21.62,43.24 22.45,42.41 U18.30
LCD_DC: length 11.7
  Top Layer w0.254: U18.33 20.95,42.4 20.12,43.23 FPC1.4
LCD_DI: length 11.7
  Top Layer w0.254: FPC1.6 21.12,43.24 21.95,42.41 U18.31
LCD_RST: length 11.7
  Top Layer w0.254: U18.32 21.45,42.41 20.62,43.24 FPC1.5
LED1: length 43.8
  Top Layer w0.254: v1(28.61,29.8) 28.34,29.53 U18.15 ; 58.96,18.59 v1(59.78,18.59) 60.54,18.59 60.76,18.81
  Bottom Layer w0.254: v1(28.61,29.8) 28.61,31.19 30.26,32.84 42.07,32.84 56.32,18.59 v1(59.78,18.59)
LED3: length 1.5
  Top Layer w0.254: U18.17 26.93,30.53 v1(27.34,30.94)
M3.3V: length 163.5
  Top Layer w0.254: C6.2 11.87,37.77 12.45,37.19 U18.50 ; 30.32,12.4 30.45,12.26 30.45,3.11 ; 23.83,27.53 23.83,23.15 24.45,22.53 U18.100 26.57,20.98 C7.2 ; 23.83,27.53 23.83,34.41 23.95,34.53 U18.27 23.95,37.2 24.55,37.8 25.3,37.8 C5.2 ; 23.83,27.53 U18.11 27.83,27.53 28.54,26.81 C4.2
  Top Layer w0.381: 10.9,22.53 8.51,22.53 7.21,21.22 7.21,20.27 7.15,20.21 v1(7.15,8.21)
  Top Layer w0.508: 30.3,15.92 27.66,18.56 C7.2 ; 30.3,15.92 32.74,18.37 36.99,18.37 38.9,20.27 38.9,32.84 37.37,34.37 R1.1 ; 30.3,15.92 v1(30.3,13.29) ; 7.21,20.27 5.75,20.27 5.11,20.91 v1(5.11,30.94) 5.11,32.17 C6.2
  Top Layer w0.762: v1(31.27,13.29) 31.27,13.22 ; 31.27,13.22 C10.1 34.56,13.22 U1.5 ; 31.27,13.22 30.36,13.22 v1(30.3,13.29) 30.3,12.4 ; R1.1 R2.1 ; v1(23.66,12.4) 30.3,12.4 ; 30.3,12.4 30.32,12.4
  Bottom Layer w0.508: v1(5.11,30.94) 11.37,30.94 11.58,31.15 11.75,30.98 U17.8
  Bottom Layer w0.762: v1(23.66,12.4) 19.47,8.21 v1(7.15,8.21) 2.07,8.21
MCU_A: length 40.7
  Top Layer w0.254: 10.9,34.03 9.77,34.03 9.3,34.5 v1(9.3,35.26) ; R29.1 26.33,59.89 16.16,59.89 v1(11.72,55.45)
  Bottom Layer w0.254: v1(9.3,35.26) 9.3,53.04 v1(11.72,55.45)
MCU_B: length 40.1
  Top Layer w0.254: 10.9,33.53 12.65,33.53 v1(12.73,33.61) ; v1(12.73,54.81) 12.73,55.7 16.54,59.51 25.24,59.51 R22.1
  Bottom Layer w0.254: v1(12.73,33.61) v1(12.73,54.81)
MCU_RX: length 20.5
  Top Layer w0.254: R25.1 15.55,55.06 13.95,53.46 U18.47
MCU_TX: length 18.5
  Top Layer w0.254: U18.46 14.45,52.22 15.78,53.55 16.29,53.55
NRST: length 32.3
  Top Layer w0.254: C2.2 30.33,29.03 25.99,29.03 ; 25.99,29.03 U18.14 ; 25.99,29.03 v1(24.42,29.03)
  Bottom Layer w0.254: v1(24.42,29.03) 5.62,29.03 2.07,25.48 2.07,23.32
OSC32_IN: length 11.1
  Top Layer w0.254: X2.2 33.71,21.41 33.31,21.81 C15.2 31.26,21.81 27.05,26.03 U18.8
OSC32_OUT: length 10.9
  Top Layer w0.254: U18.9 27.43,26.53 30.71,23.25 C14.2 33.37,23.25 34.08,23.96 X2.1
OSC_IN: length 11.9
  Top Layer w0.254: 32.35,27.45 33.31,26.49 35.85,26.49 36.19,26.84 X1.3 ; 32.35,27.45 C13.2 ; 32.35,27.45 31.78,28.03 U18.12
OSC_OUT: length 9.1
  Top Layer w0.254: X1.1 33.91,29.3 C16.1 31.66,28.53 U18.13
P_5V: length 35.5
  Top Layer w0.254: R34.1 R37.1 53.24,65.77 53.28,65.73
  Top Layer w0.762: U10.6 61.24,65.73 U11.3 47.47,63.45 C35.2 47.34,63.32 C36.2 45.57,63.45 U11.1
PA1: length 19.8
  Top Layer w0.254: U18.23 28.66,33.53 29.32,34.19 29.32,39.36 28.14,40.54 26.84,40.54 24.12,43.26 FPC1.12
PA2: length 18.9
  Top Layer w0.254: U18.24 28.14,34.03 28.97,34.85 28.97,39.21 27.99,40.19 26.69,40.19 23.62,43.25 FPC1.11
PA3: length 20.7
  Top Layer w0.254: U18.25 27.75,34.53 28.61,35.38 28.61,39.07 27.85,39.83 26.54,39.83 23.12,43.25 FPC1.10 23.12,49.33 R38.1
PA4: length 14.3
  Top Layer w0.254: R39.1 22.62,49.37 FPC1.9 22.64,47.45 22.64,43.23 23.45,42.42 U18.28
PA9: length 13.4
  Top Layer w0.254: v1(8.42,26.75) 9.04,26.75 9.76,26.03 10.9,26.03
  Bottom Layer w0.254: 2.07,20.78 2.07,21.03 3.59,22.56 3.59,25.35 4.99,26.75 v1(8.42,26.75)
PA10: length 16.2
  Top Layer w0.254: v1(12.73,23.95) 12.73,25.1 12.3,25.53 10.9,25.53
  Bottom Layer w0.254: v1(12.73,23.95) 12.35,23.57 7.4,23.57 H1.5
PA11: length 51.7
  Top Layer w0.254: 10.9,25.03 10.01,25.03 v1(9.56,25.48) ; R7.2 v1(42.2,5.67)
  Bottom Layer w0.254: v1(9.56,25.48) 9.99,25.05 21.8,25.05 26.22,20.63 26.22,8.08 29.27,5.03 42.11,5.03 42.2,5.12 v1(42.2,5.67)
PA12: length 51.6
  Top Layer w0.254: 10.9,24.53 9.88,24.53 v1(9.56,24.21) ; R6.2 v1(42.2,4.02)
  Bottom Layer w0.254: v1(42.2,4.02) 42.2,4.53 42.11,4.62 29.1,4.62 25.82,7.91 25.82,20.4 21.57,24.64 9.99,24.64 v1(9.56,24.21)
PA13: length 20
  Top Layer w0.254: v1(12.73,22.94) 12.43,23.24 12.43,23.37 11.77,24.03 10.9,24.03
  Bottom Layer w0.254: v1(12.73,22.94) 12.73,19.76 12.1,19.13 11.58,19.13 3.07,10.62 H1.2
PA14: length 14.1
  Top Layer w0.254: v1(11.08,19.64) 12.1,19.64 12.45,19.99 U18.76
  Bottom Layer w0.254: v1(11.08,19.64) 4.73,13.29 2.07,13.29
PA15: length 4.5
  Top Layer w0.254: U18.77 12.95,19.47 12.35,18.87 R14.1
PB1: length 1.7
  Top Layer w0.254: U18.35 19.95,34.9 v1(20.35,34.5)
PB2: length 12.8
  Top Layer w0.254: U18.36 19.45,31.08 19.72,30.81 19.72,29.92 19.59,29.8 18.45,29.8 18.19,29.53 18.19,28.9 17.69,28.4 v1(16.29,28.4)
  Bottom Layer w0.254: U17.6 14.28,28.4 v1(16.29,28.4)
PB6: length 12.7
  Top Layer w0.254: v1(23.02,30.94) 23.02,25.1 20.45,22.53 U18.92
  Bottom Layer w0.254: v1(23.02,30.94) 21.37,30.94 21.32,30.98
PB9: length 27.9
  Top Layer w0.254: R13.1 45.87,14.55 v1(45.88,14.56) ; v1(28.86,15.95) 25.94,15.95 22.45,19.45 U18.96
  Bottom Layer w0.254: v1(45.88,14.56) 44.48,15.95 v1(28.86,15.95)
PC6: length 19.1
  Top Layer w0.254: 10.9,28.53 14.51,28.53 17.56,31.57 v1(17.56,34.11)
  Bottom Layer w0.254: U15.18 20.04,36.59 v1(17.56,34.11)
PC7: length 20.7
  Top Layer w0.254: v1(18.58,33.86) 18.58,31.57 15.03,28.03 10.9,28.03
  Bottom Layer w0.254: v1(18.58,33.86) 22.04,37.32 U15.17
PC8: length 18.5
  Top Layer w0.254: 10.9,27.53 12.72,27.53 14.26,25.99 v1(14.26,22.94)
  Bottom Layer w0.254: v1(14.26,22.94) 16.42,22.94 20.01,19.35 U4.7
PC9: length 18.7
  Top Layer w0.254: v1(13.5,23.7) 13.5,25.86 12.33,27.03 10.9,27.03
  Bottom Layer w0.254: v1(13.5,23.7) 16.42,23.7 21.11,19.01 U4.8
PC10: length 5.9
  Top Layer w0.254: v1(13.5,17.1) 13.45,17.14 U18.78
  Bottom Layer w0.254: U4.1 13.41,17 v1(13.5,17.1)
PC11: length 6.1
  Top Layer w0.254: U18.79 13.95,17.79 v1(14.51,17.22)
  Bottom Layer w0.254: U4.2 14.51,17.22 v1(14.51,17.22)
PC12: length 8.4
  Top Layer w0.254: U18.80 14.45,18.68 v1(15.02,18.11)
  Bottom Layer w0.254: U4.5 17.8,17.36 17.05,18.11 v1(15.02,18.11)
PD2: length 6
  Top Layer w0.254: v1(15.66,17.35) 15.95,17.64 U18.83
  Bottom Layer w0.254: U4.3 15.61,17.3 v1(15.66,17.35)
PD11: length 12.7
  Top Layer w0.254: v1(9.3,28.27) 9.3,30.69 9.65,31.03 10.9,31.03
  Bottom Layer w0.254: v1(9.3,28.27) 9.3,27.13 9.56,26.88 10.28,26.88 10.58,27.17 10.58,28.27 10.83,28.53 11.59,28.53 11.85,28.27 11.85,27.44 12.12,27.17 U17.5
PD12: length 12.8
  Top Layer w0.254: v1(13.24,31.83) 11.94,30.53 10.9,30.53
  Bottom Layer w0.254: 21.32,29.71 19.68,29.71 17.69,31.7 17.69,32.21 17.31,32.59 15.91,32.59 15.33,32.01 13.42,32.01 v1(13.24,31.83)
PD13: length 12.8
  Top Layer w0.254: 10.9,30.03 12.58,30.03 v1(12.73,30.18)
  Bottom Layer w0.254: v1(12.73,30.18) 12.86,30.3 15.78,30.3 16.42,30.94 16.92,30.94 17.05,30.81 17.05,30.43 17.18,30.3 17.81,30.3 18.07,30.05 18.07,29.67 17.81,29.42 17.43,29.42 17.18,29.67 16.8,29.67 16.54,29.42 16.04,29.42 15.91,29.54 15.91,29.59 15.78,29.71 U17.7
PD14: length 35.3
  Top Layer w0.254: v1(26.32,48.59) 28.17,48.59 28.23,48.53 28.55,48.53 R35.2 ; 10.9,29.53 14.37,29.53 16.42,31.57 v1(16.42,34.11)
  Bottom Layer w0.254: v1(16.42,34.11) 19.21,36.91 19.21,47.26 20.69,48.74 U15.13 24.43,48.59 v1(26.32,48.59)
PE2: length 12.8
  Top Layer w0.254: v1(24.42,24.46) 24.42,23.18 25.07,22.53 U18.1
  Bottom Layer w0.254: 21.32,28.44 24.25,28.44 24.67,28.02 24.67,27.51 24.29,27.13 23.15,27.13 22.89,26.88 22.89,26.37 23.15,26.11 24.04,26.11 24.42,25.73 v1(24.42,24.46)
RX: length 11
  Top Layer w0.254: U16.13 31.97,68.59 31.53,68.16 31.53,65.48 31.15,65.1 28.47,65.1 R27.2
SW_A: length 6.9
  Top Layer w0.254: U16.10 37.31,66.69 38.51,65.49 R30.2
SW_B: length 7.8
  Top Layer w0.254: U16.9 36.93,66.05 37.75,65.23 37.75,62.32 38.15,61.93 R23.2
TTL_RX: length 25.5
  Top Layer w0.254: U16.14 35.31,69.23 35.63,69.55 v1(38.01,69.55) ; R36.2 48.49,78.63 Q6.2 49.96,71.98 v1(48.29,70.31)
  Bottom Layer w0.254: v1(38.01,69.55) 38.77,70.31 v1(48.29,70.31)
TTL_RXD: length 10.1
  Top Layer w0.254: R37.2 51.96,77.02 Q6.3 51.96,86.07 CN3.2
TTL_TX: length 34.2
  Top Layer w0.254: v1(48.42,69.29) 52.48,73.36 52.48,78.06 53.26,78.83 R33.2 55.73,78.83 Q5.2 ; U16.5 30.2,67.96 v1(30.39,68.15)
  Bottom Layer w0.254: v1(48.42,69.29) 47.77,68.64 30.88,68.64 v1(30.39,68.15)
TTL_TXD: length 11.1
  Top Layer w0.254: R34.2 57.82,77.43 57.82,79.69 Q5.3 57.8,84.04 CN3.3
TX: length 13.2
  Top Layer w0.254: R26.2 26.07,62.68 26.07,64.27 27.29,65.48 30.13,65.48 31.02,66.37 31.02,68.78 30.58,69.23 U16.3
USB_D+: length 13
  Top Layer w0.254: USB1.A6 51.47,8.46 51.73,8.71 52.23,8.71 52.47,8.47 USB1.B6 52.47,6.16 50.83,4.52 45.36,4.52 R6.1
USB_D-: length 10.6
  Top Layer w0.254: USB1.A7 51.97,6.55 51.58,6.16 ; 51.58,6.16 50.58,5.16 45.36,5.16 R7.1 ; 51.58,6.16 51.38,6.16 50.97,6.57 USB1.B7
USB_GND: length 16.5
  Top Layer w0.254: v1(51.47,17.73) 51.47,17.7 51.48,17.69 ; 51.48,17.69 R12.2 ; 51.48,17.69 51.48,18.14 52.02,18.68 ; USB1.B1A12 54.92,8.23 56.17,9.48 v1(56.17,15.57)
  Bottom Layer w0.254: v1(56.17,15.57) 54.01,17.73 v1(51.47,17.73)
$1N1483: length 4.8
  Top Layer w0.254: R3.1 22.51,18.24 21.45,19.3 U18.94
$1N1691: length 4.4
  Top Layer w0.254: 10.9,23.53 6.53,23.53 C11.2
$1N1747: length 3.7
  Top Layer w0.254: 12.04,39.19 13.45,37.78 U18.48
$1N2666: length 10.2
  Top Layer w0.254: R2.2 30.64,35.89 30.13,35.38 30.13,33.61 29.05,32.53 U18.21
  Top Layer w0.762: R2.2 32.05,37.47 C3.2
$1N2790: length 8
  Top Layer w0.254: U18.20 29.57,32.03 30.39,32.84 C1.1
  Top Layer w0.762: C1.1 32.05,32.9 R1.2
$1N5326: length 9.5
  Top Layer w0.254: v1(50.45,6.3) 50.45,7.5 USB1.A5 ; R4.1 58.06,5.67 v1(57.31,5.67)
  Bottom Layer w0.254: v1(50.45,6.3) 51.34,5.41 57.06,5.41 v1(57.31,5.67)
$1N5343: length 10
  Top Layer w0.254: USB1.B5 53.47,5.31 54.39,4.4 59.34,4.4 59.73,4.79 R5.1
$1N15715: length 10.1
  Top Layer w0.762: U1.1 36.87,11.71 C9.2 36.86,11.57 36.86,5.37 38.38,3.85
$2N1784: length 16.9
  Top Layer w0.762: L2.2 48.34,53.81 C34.2 61.95,53.73 U10.1
$2N4816: length 6.4
  Top Layer w0.381: U7.3 40.29,78.69 40.93,79.33 42.96,79.33 43.79,80.15 C24.2
$2N4817: length 5.6
  Top Layer w0.381: U7.4 39.02,78.92 39.94,79.83 42.14,79.83 42.52,80.22 42.52,80.85
$2N4818: length 5.5
  Top Layer w0.381: U7.5 37.75,79.33 38.39,79.96 39.15,79.96 40.29,81.1 40.86,81.1 C23.1
$2N4819: length 3.1
  Top Layer w0.381: C25.2 37.05,79.77 36.48,79.2 U7.6
$2N4832: length 2.9
  Top Layer w0.381: U7.1 43.59,78.75 C24.1
$2N4833: length 5.1
  Top Layer w0.381: C19.1 45.12,76.6 41.88,76.6 41.56,76.91 41.56,78
$2N6743: length 6
  Top Layer w0.254: R22.2 29.57,59.39 32.17,59.39 32.42,59.13 32.42,57.95
$2N6746: length 7.3
  Top Layer w0.254: U14.3 33.69,59.51 33.31,59.89 28.6,59.89 R29.2
$2N6747: length 6.6
  Top Layer w0.254: 32.42,63.36 32.42,61.67 32.67,61.42 36.49,61.42 R23.1
$2N6750: length 5.7
  Top Layer w0.254: U14.6 33.69,62.31 34.07,61.93 35.72,61.93 36.1,62.31 36.1,63.2 36.36,63.45 R30.1
$2N7260: length 7.7
  Top Layer w0.254: R24.2 17.43,53.55 17.18,53.8 17.18,55.58 17.56,55.96 19.97,55.96 20.86,56.85 U13.2
$2N7292: length 6.5
  Top Layer w0.254: U13.3 22.13,55.7 21.49,55.06 R25.2
$2N7323: length 6.1
  Top Layer w0.254: R26.1 24.81,61.42 21.37,61.42 20.86,61.93 U13.7
$2N7355: length 5.8
  Top Layer w0.254: U13.6 22.13,61.93 22.26,61.8 24.16,61.8 24.42,62.05 24.42,63.32 24.55,63.45 R27.1
$2N11928: length 13.8
  Top Layer w0.254: v1(12.35,13.16) 12.35,15.26
  Bottom Layer w0.254: v1(12.35,13.16) 21.88,13.16 22.26,13.54 22.26,15.06 U4.9
$2N21888: length 3.4
  Top Layer w0.254: 44.99,12.9 46.44,12.9 Q4.1 46.91,13.36 R16.1
$2N28440: length 7.1
  Top Layer w0.254: Q2.1 48.42,16.65 R10.2 48.61,16.46 48.68,16.46 49.31,15.83 49.31,12.52 Q4.3
$2N39097: length 3.6
  Top Layer w0.254: U9.3 54.78,28.17 R20.2 R18.1
$2N39101: length 1.9
  Top Layer w0.254: 57.57,32.33 57.57,31.61 U9.6
$2N39122: length 1.9
  Top Layer w0.254: R9.1 62.36,22.47 U3.5
$2N41337: length 2.8
  Top Layer w0.254: 26.12,67.3 28.88,67.3 arc(28.9,67.31) U16.6

## Copper pours and planes (outline as drawn; the poured copper is in the pictures)
5V on Top Layer: 46.52,15.83 47.37,15.83 47.73,16.19 47.73,19.33 48.67,20.27 51.98,20.27 52.87,19.38 52.87,18.11 52.48,17.73 52.48,16.08 52.61,15.95 53.76,15.95 54.01,16.21 54.01,17.99 54.39,18.37 54.64,18.37 54.64,19.67 53.97,19.67 53.5,20.14 53.5,21.54 53.25,21.8 47.53,21.8 46.9,21.16 46.9,18.49 46.52,18.11
D3.3V on Top Layer: 35.85,36.78 36.1,36.53 44.42,36.53 44.68,36.27 44.68,37.85 43.85,38.69 43.85,38.81 35.98,38.81 35.85,38.69
GND on Top Layer: -0.03,60.08 64.68,60.08 64.68,-0.56 -0.03,-0.56
GND on Bottom Layer: -0.03,60.08 64.68,60.08 64.68,-0.56 -0.03,-0.56
PGND on Bottom Layer: 0.03,94.57 64.17,94.57 64.17,60.66 -0.09,60.66 -0.09,94.44
PVDD on Top Layer: 42.71,69.29 46.01,69.29 46.01,67.39 42.71,67.39
VBUS on Top Layer: 48.93,6.81 49.56,6.81 49.56,8.21 50.45,9.09 53.12,9.09 53.76,8.46 53.76,6.94 54.39,6.94 54.39,8.33 55.41,9.35 55.53,9.35 55.66,9.48 55.66,21.29 53.76,21.29 53.63,21.16 53.63,20.14 53.76,20.02 54.9,20.02 54.9,17.73 54.26,17.1 54.26,15.95 53.76,15.44 52.61,15.44 52.36,15.19 52.36,12.02 51.47,12.02 48.93,9.48
VBUS on Top Layer: 59.09,22.94 59.22,22.81 59.22,19.89 58.96,19.64 58.2,19.64 58.2,17.6 55.53,17.6 55.28,17.86 55.28,18.49 55.66,18.87 57.44,18.87 57.44,22.81 57.57,22.94
BAT+ on Top Layer: 58.94,23.93 58.96,23.95 58.96,25.1 59.09,25.22 59.09,25.73 59.22,25.86 59.85,25.86 59.98,25.99 59.98,29.8 60.49,30.3 62.9,30.3 62.9,32.08 62.77,32.21 59.34,32.21 58.96,31.83 58.96,30.94 58.2,30.18 56.04,30.18 55.91,30.3 55.91,31.83 56.3,32.21 56.3,34.62 54.9,34.62 54.9,31.95 55.03,31.95 55.03,30.3 55.12,30.3 55.41,30.02 55.41,29.67 55.79,29.29 55.79,28.65 56.04,28.4 57.95,28.4 58.07,28.27 58.07,24.08 58.23,23.93
BAT_5V on Top Layer: 50.07,22.43 50.33,22.18 54.9,22.18 54.9,24.01 54.57,24.34 53.37,24.34 52.23,25.48 52.23,29.42 50.07,29.42
$1N15715 on Top Layer: 37.45,13.69 37.45,12.65 35.34,12.65 35.34,15.71 37.75,15.71 37.75,14.83 36.23,14.83 36.23,13.69
$2N3676 on Top Layer: 55.53,23.93 55.53,22.18 55.91,21.8 55.91,19.25 56.04,19.13 56.93,19.13 57.18,19.38 57.18,23.95 55.56,23.95
$2N3681 on Top Layer: 51.72,13.03 51.85,13.16 51.85,15.46 51.48,15.83 51.09,15.83 50.77,16.14 50.77,19.6 50.36,20.02 49.44,20.02 49.31,19.89 49.31,16.59 49.69,16.21 49.69,13.41 50.07,13.03
$2N39094 on Top Layer: 54.77,30.43 54.77,31.47 54.26,31.98 54.26,34.62 50.45,34.62 49.95,34.11 49.95,32.08 50.58,31.45 52.74,31.45 52.74,30.56 52.87,30.43

Small or netless copper shapes (teardrops, artwork), in the pictures only: 469 on Top Layer, 87 on Bottom Layer

## Text on the board
Top Solder Mask Layer: 485 | 232 | TTL
Top Silkscreen Layer: GND | B | A | TX | RX | CKL | DIO | 3.3V | WAKEUP | M3.3V | OFF | P3.3V | ON | D3.3V | P5V | BAT+ | RST
